# Altium schematic sheet P05_Debugger.SchDoc
size C; SheetNumber: 5; SheetTotal: 6
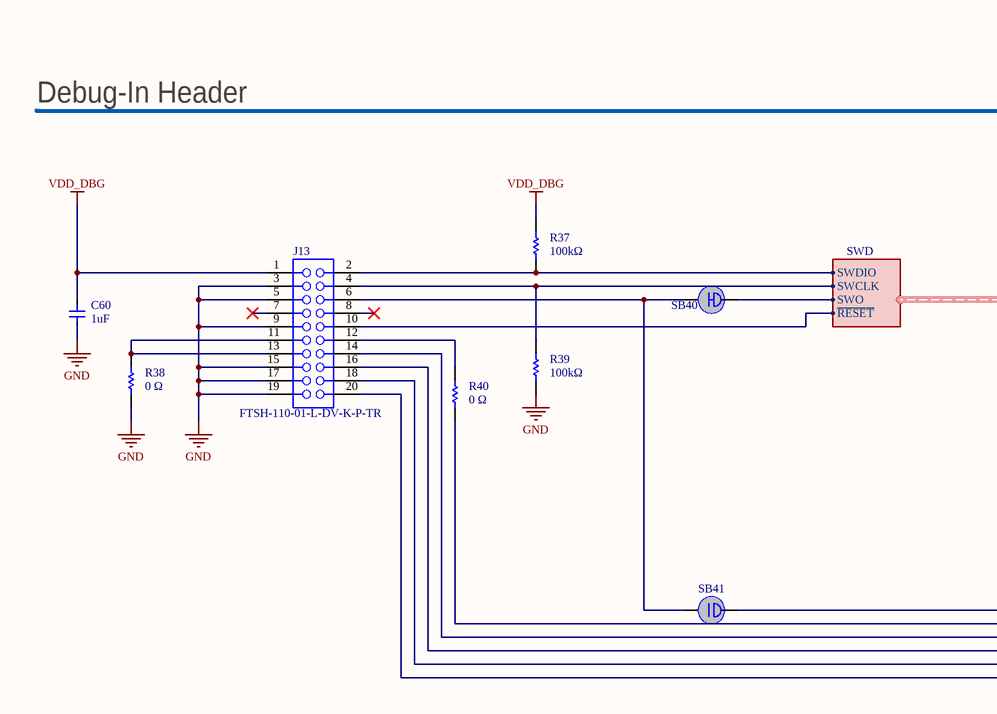
[diagram p0: P05_Debugger.SchDoc, left]
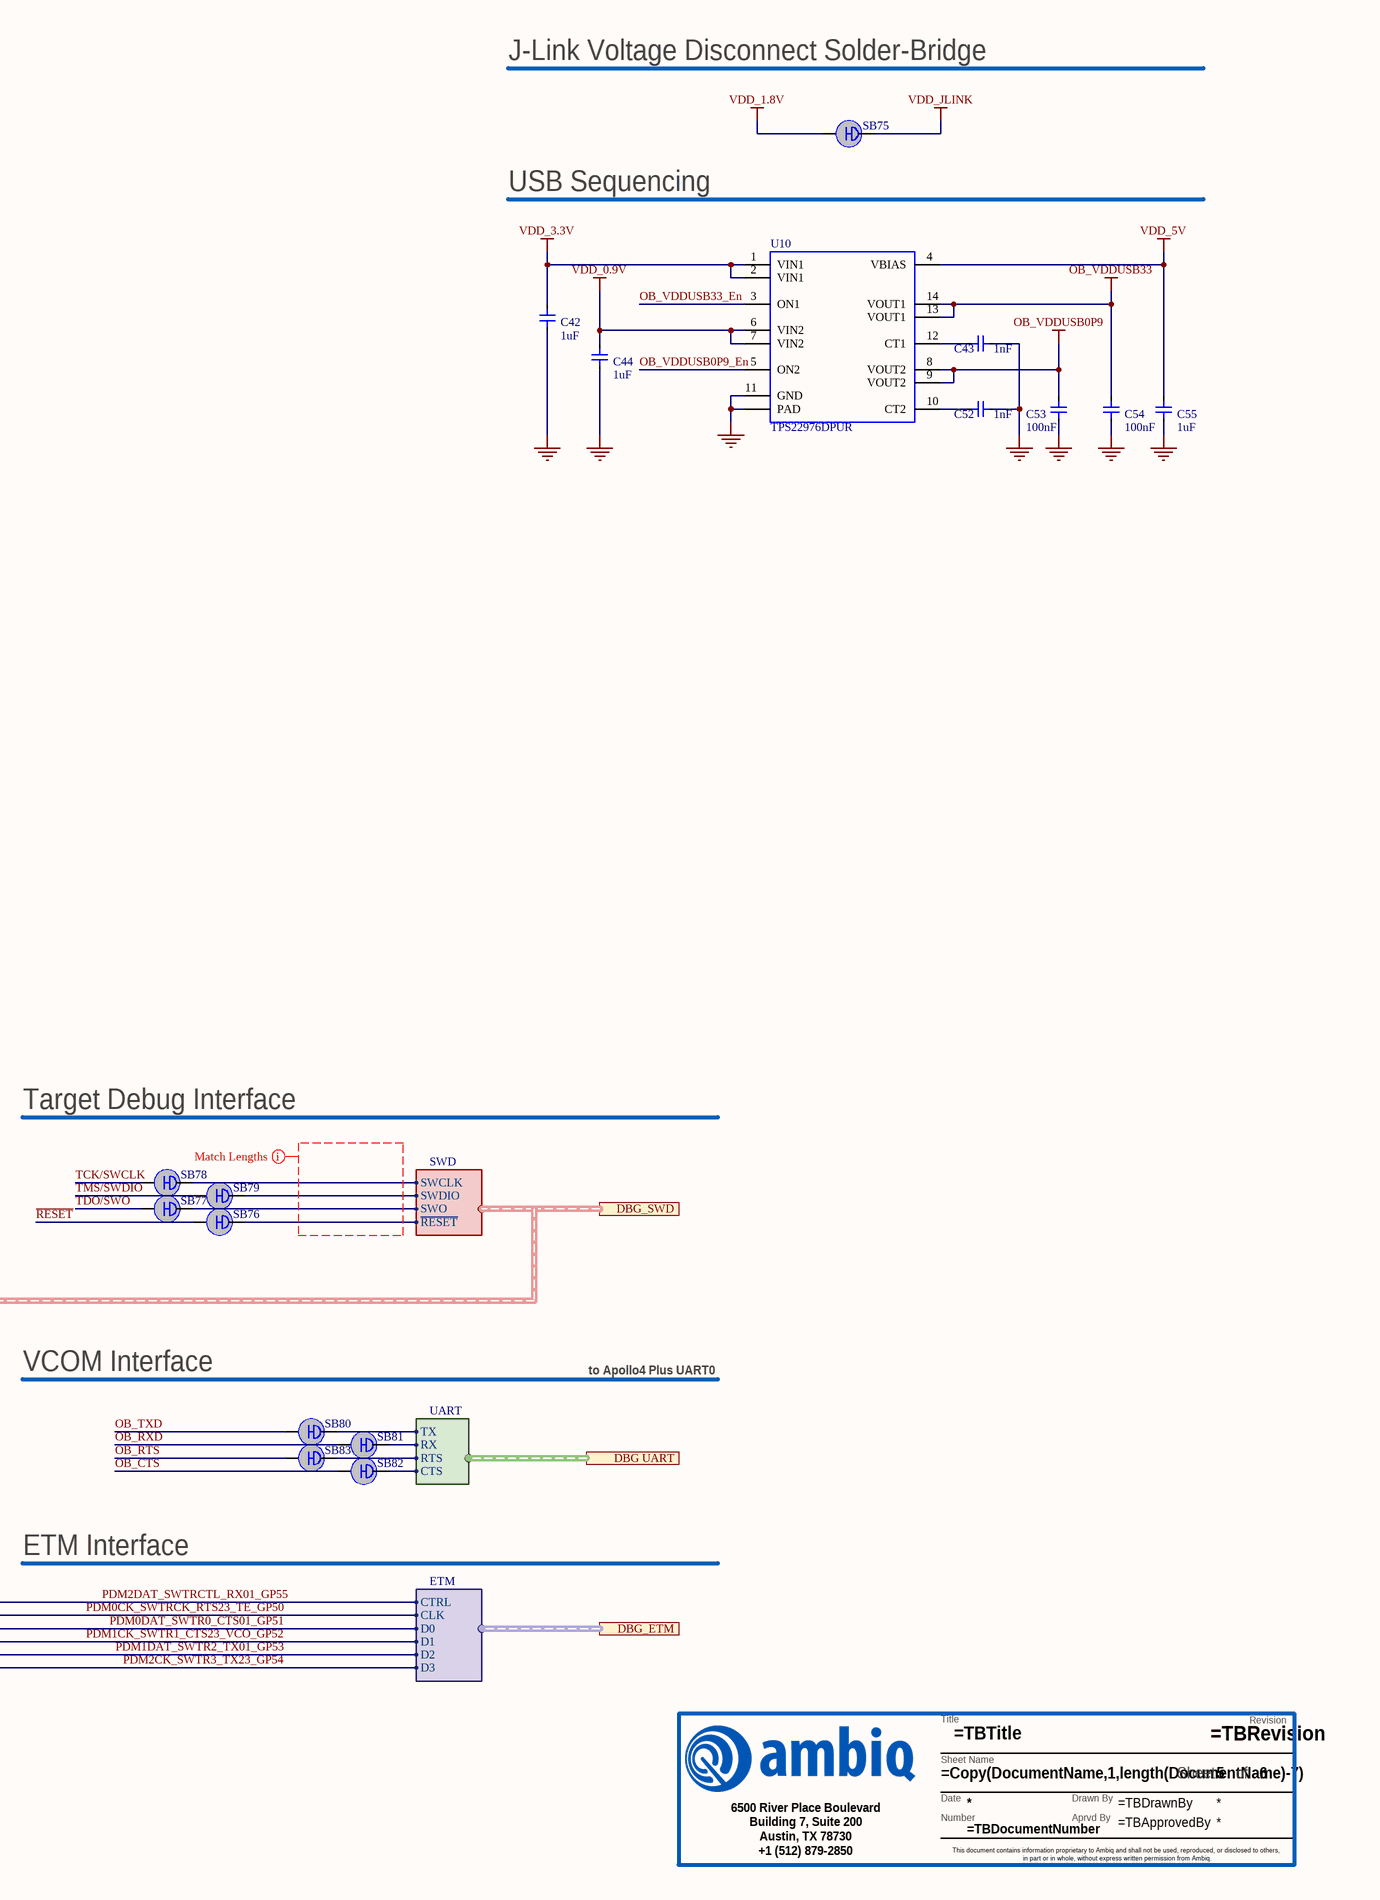
[diagram p1: P05_Debugger.SchDoc, right]

## Parts
?  TitleBlock  (value not drawn)  (graphical)
C42  1uF  [IPC_C]
C43  1nF  [IPC_C]
C44  1uF  [IPC_C]
C52  1nF  [IPC_C]
C53  100nF  [IPC_C]
C54  100nF  [IPC_C]
C55  1uF  [IPC_C]
C60  1uF  [IPC_A]
J13  FTSH-110-01-L-DV-K-P-TR  [SAMTEC_FTSH-110-X-X-DV]
R37  100kΩ  [IPC_A]
R38  0 Ω  [IPC_A]
R39  100kΩ  [IPC_A]
R40  0 Ω  [IPC_A]
SB40  Solder short  [SB39X18_SHORTED]  (value not drawn)  (net tie, no BOM)
SB41  Solderbridge  [SB39X18]  (value not drawn)  (no BOM)
SB75  Solder short  [SB39X18_SHORTED]  (value not drawn)  (net tie, no BOM)
SB76  Solder short  [SB39X18_SHORTED]  (value not drawn)  (net tie, no BOM)
SB77  Solder short  [SB39X18_SHORTED]  (value not drawn)  (net tie, no BOM)
SB78  Solder short  [SB39X18_SHORTED]  (value not drawn)  (net tie, no BOM)
SB79  Solder short  [SB39X18_SHORTED]  (value not drawn)  (net tie, no BOM)
SB80  Solder short  [SB39X18_SHORTED]  (value not drawn)  (net tie, no BOM)
SB81  Solder short  [SB39X18_SHORTED]  (value not drawn)  (net tie, no BOM)
SB82  Solder short  [SB39X18_SHORTED]  (value not drawn)  (net tie, no BOM)
SB83  Solder short  [SB39X18_SHORTED]  (value not drawn)  (net tie, no BOM)
U10  TPS22976DPUR  [R-PWSON50P300x200-N14]

## Ports
DBG UART (harness UART), DBG_ETM (harness ETM), DBG_SWD (harness SWD)

## Harnesses
UART: TX, RX, RTS, CTS
SWD: SWCLK, SWDIO, SWO, ~{RESET}
ETM: CLK, D0, D1, D2, D3, CTRL

## Nets
GND: C42.2 C43.2 C44.2 C52.2 C53.2 C54.2 C55.2 C60.2 J13.3(A2) J13.5(A3) J13.9(A5) J13.15 J13.17 J13.19 R38.1 R39.1 U10.11(GND) U10.PAD
OB_VDDUSB0P9: C53.1 U10.8(VOUT2) U10.9(VOUT2)
OB_VDDUSB33: C54.1 U10.13(VOUT1) U10.14(VOUT1)
VDD_0.9V: C44.1 U10.6(VIN2) U10.7(VIN2)
VDD_1.8V: SB75.1
VDD_3.3V: C42.1 U10.1(VIN1) U10.2(VIN1)
VDD_5V: C55.1 U10.4(VBIAS)
VDD_DBG: C60.1 J13.1(A1) R37.2
VDD_JLINK: SB75.2
~{RESET}: SB76.1
OB_CTS: SB82.1
OB_RTS: SB83.1
OB_RXD: SB81.1
OB_TXD: SB80.1
OB_VDDUSB0P9_En: U10.5(ON2)
OB_VDDUSB33_En: U10.3(ON1)
PDM0CK_SWTRCK_RTS23_TE_GP50: R40.1 ; port DBG_ETM.CLK
PDM0DAT_SWTR0_CTS01_GP51: J13.14 ; port DBG_ETM.D0
PDM1CK_SWTR1_CTS23_VCO_GP52: J13.16 ; port DBG_ETM.D1
PDM1DAT_SWTR2_TX01_GP53: J13.18 ; port DBG_ETM.D2
PDM2CK_SWTR3_TX23_GP54: J13.20 ; port DBG_ETM.D3
PDM2DAT_SWTRCTL_RX01_GP55: SB41.2 ; port DBG_ETM.CTRL
TCK/SWCLK: SB78.1
TDO/SWO: SB77.1
TMS/SWDIO: SB79.1
NetC43_1: C43.1 U10.12(CT1)
NetC52_1: C52.1 U10.10(CT2)
NetJ13_2: J13.2(B1) R37.1 SB79.2 ; port DBG_SWD.SWDIO
NetJ13_4: J13.4(B2) R39.2 SB78.2 ; port DBG_SWD.SWCLK
NetJ13_6: J13.6(B3) SB40.1 SB41.1
NetJ13_10: J13.10(B5) SB76.2 ; port DBG_SWD.~{RESET}
NetJ13_11: J13.11 J13.13 R38.2
NetJ13_12: J13.12 R40.2
NetSB40_2: SB40.2 SB77.2 ; port DBG_SWD.SWO
NetSB80_2: SB80.2 ; port DBG UART.TX
NetSB81_2: SB81.2 ; port DBG UART.RX
NetSB82_2: SB82.2 ; port DBG UART.CTS
NetSB83_2: SB83.2 ; port DBG UART.RTS

Not connected (* = marked no-connect by the designer): J13 7(A4)* 8(B4)*

## Layout directives
net class Target Debug; rule Matched Net Lengths [Tolerance = 200mil]: (no net found under the mark)

## Notes on the sheet
- J-Link Voltage Disconnect Solder-Bridge
- USB Sequencing
- Debug-In Header
- Target Debug Interface
- VCOM Interface
- to Apollo4 Plus UART0
- ETM Interface
- (in symbol TitleBlock) Revision; Title; Sheet Name; Sheet; of; Date; Drawn By; Number; Aprvd By; 6500 River Place Boulevard / Building 7, Suite 200 / Austin, TX 78730 / +1 (512) 879-2850; This document contains information proprietary to Ambiq and shall not be used, reproduced, or disclosed to others, / in part or in whole, without express written permission from Ambiq.

## Library data of the parts
? = TitleBlock: Title block for Ambiq Schematics. Please have the following parameters entered in Project>Project Options>Parameters: / TBTitle / TBDocumentNumber / TBRevision / TBDrawnBy / TBApprovedBy; AMBIQ PN: TitleBlock
C42 C44 C55 C60 = CL05A105MP5NNNC: NONE; Manufacturer: Samsung; Tolerance: 20%; Voltage Rating: 10V; Dielectric: X5R; AMBIQ PN: CL05A105MP5NNNC; Supplier 1: Newark; Supplier Part Number 1: 82AC9187; Manufacturer Part Number: CL05A105MP5NNNC; RoHS: Yes; Category: Ceramic Capacitors; Pricing 1: 50000=0.10000 (USD); Mount: Surface Mount; Case/Package: 0402; Case Code (Metric): 1005; Case Code (Imperial): 0402; Min Operating Temperature: -55°C; Max Operating Temperature: 85°C; Capacitance: 1uF; Packaging: Tape and Reel; Voltage Rating (DC): 10V; Series: CL; Construction: Flat; Length: 1mm; Width: 0.02inch; Height: 0.5mm; Thickness: 0.022inch; Depth: 0.5mm; Radiation Hardening: No; Lead Free: Lead Free; RoHS Compliant: Yes; ComponentLink1URL: https://datasheet.ciiva.com/25802/cl05a105mp5nnnc-25802049.pdf?src-supplier=Digi-Key; ComponentLink1Description: https://datasheet.ciiva.com/25802/cl05a105mp5nnnc-25802049.pdf?src-supplier=Digi-Key; Package Quantity: 1
C43 C52 = GRM1555C1H102JA01D: NONE; Manufacturer: Murata; Tolerance: 5%; Voltage Rating: 50V; Dielectric: C0G; Dielectric Material: Ceramic; Insulation Resistance: 10GR; Temperature Coefficient: 30ppm/°C; AMBIQ PN: GRM1555C1H102JA01D; Supplier 1: Arrow Electronics; Supplier Part Number 1: GRM1555C1H102JA01D; Manufacturer Part Number: GRM1555C1H102JA01D; RoHS: Yes; Category: Ceramic Capacitors; Stock 1: 3380000; Pricing 1: 10000=0.00710, 20000=0.00680, 30000=0.00660, 50000=0.00590, 100000=0.00470 (USD); Mount: Surface Mount; Case/Package: 0402; Case Code (Metric): 1005; Case Code (Imperial): 0402; Min Operating Temperature: -55°C; Max Operating Temperature: 125°C; Capacitance: 1nF; Packaging: Tape and Reel; Voltage: 50V; Voltage Rating (DC): 50V; Series: GRM; Construction: Flat; Length: 1mm; Width: 0.5mm; Height: 0.5mm; Thickness: 0.022inch; Depth: 0.5mm; Radiation Hardening: No; REACH SVHC: No SVHC; Lead Free: Lead Free; RoHS Compliant: Yes; ComponentLink1URL: https://datasheet.ciiva.com/34302/1855908-34302849.pdf?src-supplier=Jameco; ComponentLink1Description: https://datasheet.ciiva.com/34302/1855908-34302849.pdf?src-supplier=Jameco; Package Quantity: 1; Termination: SMD/SMT; Number of Pins: 2; Material: Ceramic; Size: 0.5mm
C53 C54 = 0201ZD104KAT2A: NONE; Manufacturer: Kyocera AVX; Tolerance: 10%; Voltage Rating: 10V; AMBIQ PN: 0201ZD104KAT2A; Supplier 1: Arrow Electronics; Supplier Part Number 1: 0201ZD104KAT2A; Manufacturer Part Number: 0201ZD104KAT2A; RoHS: Yes; Category: Ceramic Capacitors; Stock 1: 105000; Pricing 1: 15000=0.00770, 30000=0.00750, 45000=0.00740, 60000=0.00720, 75000=0.00690, 150000=0.00620 (USD); Mount: Surface Mount; Case/Package: 0201; Case Code (Metric): 0603; Case Code (Imperial): 0201; Min Operating Temperature: -55°C; Max Operating Temperature: 85°C; Capacitance: 100nF; Packaging: Tape and Reel; Voltage Rating (DC): 10V; Series: -; Lead Free: Lead Free; RoHS Compliant: Yes; ComponentLink1URL: http://www.mouser.com/ds/2/40/cx5r-776519.pdf?src-supplier=Mouser; ComponentLink1Description: http://www.mouser.com/ds/2/40/cx5r-776519.pdf?src-supplier=Mouser
J13 = FTSH-110-01-L-DV-K-P-TR: None; Manufacturer: Samtec; Connector Type: Male Pin; Number of Contacts: 20; Pitch: 1.27mm; Max Current Rating: 1.75A; Row Spacing: 0.05inch; AMBIQ PN: FTSH-110-01-L-DV-K-P-TR; Supplier 1: Arrow Electronics; Supplier Part Number 1: FTSH-110-01-L-DV-K-P-TR; Manufacturer Part Number: FTSH-110-01-L-DV-K-P-TR; RoHS: Yes; Category: Headers and Wire Housings; Stock 1: 3600; Pricing 1: 400=4.22000 (USD); Mount: Surface Mount; Contact Material: Bronze; Contact Plating: Gold; Housing Material: Polymer; Min Operating Temperature: -55°C; Max Operating Temperature: 125°C; Packaging: Tape and Reel; Orientation: Straight; Termination: Solder; Length: 12.7mm; ComponentLink1URL: https://datasheet.ciiva.com/738/ftsh-1xx-xx-xxx-dv-xxx-mkt-738875.pdf?src-supplier=Digi-Key; ComponentLink1Description: https://datasheet.ciiva.com/738/ftsh-1xx-xx-xxx-dv-xxx-mkt-738875.pdf?src-supplier=Digi-Key; Housing Color: Black; Number of Rows: 2; Number of Positions: 20; Series: FTSH; Depth: 3.43mm; Radiation Hardening: No; Color: Black; Contact Type: Male Pin; Package Quantity: 400; Contact Mating Length: 0.12inch; Lead Free: Lead Free
R37 R39 = ERJ-2RKF1003X: RES SMD 100K OHM 1% 1/10W 0402; Manufacturer: Panasonic; Resistance: 100kR; Power Rating: 100mW; Voltage Rating: 50V; Temperature Coefficient: 100ppm/°C; AMBIQ PN: ERJ-2RKF1003X; Supplier 1: Arrow Electronics; Supplier Part Number 1: ERJ-2RKF1003X; Manufacturer Part Number: ERJ-2RKF1003X; RoHS: Yes; Category: Chip SMD Resistors; Stock 1: 267708; Pricing 1: 10000=0.00840 (USD); Mount: Surface Mount; Case/Package: 0402; Weight: 0.000388oz; Case Code (Metric): 1005; Case Code (Imperial): 0402; Contact Plating: Tin; Min Operating Temperature: -55°C; Max Operating Temperature: 155°C; Package Quantity: 10000; Packaging: Cut Tape; Resistor Type: Thick Film; Number of Terminations: 2; Termination: SMD/SMT; Max Power Dissipation: 100mW; Voltage Rating (DC): 50V; Features: Automotive AEC-Q200; Series: ERJ-2Rx; Technology: THICK FILM; Length: 1mm; Width: 0.5mm; Height: 0.35mm; Depth: 0.5mm; Radiation Hardening: No; REACH SVHC: No SVHC; Military Standard: Not; Lead Free: Lead Free; RoHS Compliant: Yes; ComponentLink1URL: https://datasheet.ciiva.com/34303/1987038-34303550.pdf?src-supplier=Jameco; ComponentLink1Description: https://datasheet.ciiva.com/34303/1987038-34303550.pdf?src-supplier=Jameco; ComponentLink2URL: https://datasheet.ciiva.com/11821/0900766b80f80784-11821175.pdf?src-supplier=RSComponents; ComponentLink2Description: https://datasheet.ciiva.com/11821/0900766b80f80784-11821175.pdf?src-supplier=RSComponents; ComponentLink3URL: https://datasheet.ciiva.com/7830/aoa0000ce2-7830725.pdf?src-supplier=Element14; Tolerance: 1%; Number of Pins: 2
R38 R40 = CRCW04020000Z0EDHP: CRCW Series 0402 0.2 W 0 Ohm Jumper Surface Mount Thick Film Chip Resistor; Manufacturer: Vishay Dale; Resistance: 0R; Power Rating: 200mW; Voltage Rating: 50V; Max Power Dissipation: 125mW; Temperature Coefficient: 0ppm/°C; AMBIQ PN: CRCW04020000Z0EDHP; Supplier 1: Newark; Supplier Part Number 1: 68R2982; Manufacturer Part Number: CRCW04020000Z0EDHP; RoHS: Yes; Category: Chip SMD Resistors; Stock 1: 60000; Pricing 1: 1=0.01500, 10000=0.01500 (USD); Mount: Surface Mount; Case/Package: 0402; Weight: 2.3E-05oz; Case Code (Metric): 1005; Case Code (Imperial): 0402; Contact Plating: Tin; Size Code: 0402; Min Operating Temperature: -55°C; Max Operating Temperature: 155°C; Package Quantity: 1; Packaging: Tape and Reel; Resistor Type: Thick Film; Number of Terminations: 2; Termination: SMD/SMT; Voltage Rating (DC): 50V; Features: Automotive AEC-Q200; Series: CRCW-HP; Technology: THICK FILM; Construction: Rectangular; Length: 1mm; Width: 0.02inch; Height: 0.3mm; Depth: 0.5mm; Radiation Hardening: No; REACH SVHC: Unknown; Military Standard: Not; Lead Free: Lead Free; RoHS Compliant: Yes; ComponentLink1URL: https://datasheet.ciiva.com/7725/crcwhpe3-7725758.pdf?src-supplier=Element14; ComponentLink1Description: https://datasheet.ciiva.com/7725/crcwhpe3-7725758.pdf?src-supplier=Element14; ComponentLink2URL: https://datasheet.ciiva.com/28621/1912814-28621324.pdf?src-supplier=Element14; ComponentLink2Description: https://datasheet.ciiva.com/28621/1912814-28621324.pdf?src-supplier=Element14; ComponentLink3URL: https://datasheet.ciiva.com/2470/crcwhpe3-2470556.pdf?src-supplier=Digi-Key
SB40 SB75-SB83 = SBS: None; AMBIQ PN: SBS
SB41 = SBO: None; AMBIQ PN: SBO
U10 = TPS22976DPUT: None; Manufacturer: Texas Instruments; Max Supply Voltage: 6V; Min Supply Voltage: 2.3V; Interface: On/Off; Output Type: Adjustable; Number of Outputs: 2; Max Output Current: 6A; Fault Protection: Over Temperature; Output Configuration: High Side; Output Current: 1A; Output Voltage: 5V; Quiescent Current: 220uA; Polarity: Positive; Accuracy: 0.5%; Dropout Voltage: 250mV; Input Bias Current: 120uA; Min Output Voltage: 800mV; Reference Voltage: 410mV; AMBIQ PN: TPS22976DPUT; Manufacturer Part Number: TPS22976DPUT; Supplier 1: Arrow Electronics; Supplier Part Number 1: TPS22976DPUT; RoHS: Yes; Category: Power Management ICs; Stock 1: 250; Pricing 1: 1=0.70530, 10=0.67280, 25=0.64030, 100=0.60770, 250=0.57510 (USD); Number of Pins: 14; Min Operating Temperature: -40°C; Max Operating Temperature: 105°C; Package Quantity: 4000; Packaging: Tape and Reel; REACH SVHC: No SVHC; Lead Free: Lead Free; RoHS Compliant: Yes; ComponentLink1URL: http://www.ti.com/general/docs/suppproductinfo.tsp?distId=10&amp;gotoUrl=http%3A%2F%2Fwww.ti.com%2Flit%2Fgpn%2Ftps22976&src-sup; ComponentLink1Description: http://www.ti.com/general/docs/suppproductinfo.tsp?distId=10&amp;gotoUrl=http%3A%2F%2Fwww.ti.com%2Flit%2Fgpn%2Ftps22976&src-sup; ComponentLink2URL: https://datasheet.ciiva.com/41458/001085984-da-01-en-ic-reg-ld-mcp1826t-adje-dc-sot-223-5-mcp-41458757.pdf?src-supplier=Conrad; ComponentLink2Description: https://datasheet.ciiva.com/41458/001085984-da-01-en-ic-reg-ld-mcp1826t-adje-dc-sot-223-5-mcp-41458757.pdf?src-supplier=Conrad; Length: 0.257inch; Width: 0.14inch; Height: 0.065inch; Radiation Hardening: No; Number of Channels: 2; Max Input Voltage: 6V; Min Input Voltage: 2.3V; Output Voltage Accuracy: 0.5%; Max Output Voltage: 5V; Termination: SMD/SMT; Halogen Free: Halogen Free